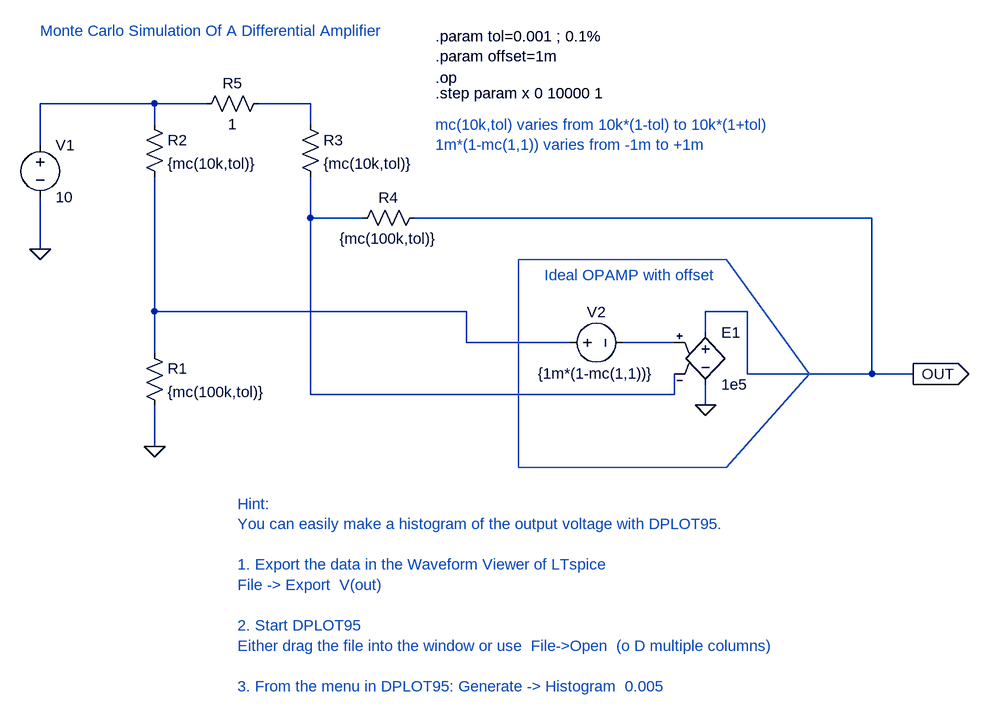
[diagram p0: schematic monte-carlo-diff-amp_1.asc]
monte-carlo-diff-amp_1.asc, the LTspice schematic file:
Version 4
SHEET 1 1364 996
WIRE 80 112 -96 112
WIRE 160 112 80 112
WIRE 320 112 240 112
WIRE 80 144 80 112
WIRE 320 144 320 112
WIRE -96 176 -96 112
WIRE 320 288 320 224
WIRE 400 288 320 288
WIRE 1184 288 480 288
WIRE -96 336 -96 256
WIRE 80 432 80 224
WIRE 560 432 80 432
WIRE 992 432 928 432
WIRE 928 464 928 432
WIRE 560 480 560 432
WIRE 720 480 560 480
WIRE 880 480 800 480
WIRE 80 496 80 432
WIRE 992 528 992 432
WIRE 1184 528 1184 288
WIRE 1184 528 992 528
WIRE 1248 528 1184 528
WIRE 320 560 320 288
WIRE 880 560 880 528
WIRE 880 560 320 560
WIRE 928 576 928 544
WIRE 80 640 80 576
FLAG -96 336 0
FLAG 80 640 0
FLAG 928 576 0
FLAG 1248 528 OUT
IOPIN 1248 528 Out
SYMBOL res 64 128 R0
SYMATTR InstName R2
SYMATTR Value {mc(10k,tol)}
SYMBOL res 64 480 R0
SYMATTR InstName R1
SYMATTR Value {mc(100k,tol)}
SYMBOL voltage -96 160 R0
SYMATTR InstName V1
SYMATTR Value 10
SYMBOL res 304 128 R0
SYMATTR InstName R3
SYMATTR Value {mc(10k,tol)}
SYMBOL res 384 304 R270
WINDOW 0 32 56 VTop 0
WINDOW 3 0 56 VBottom 0
SYMATTR InstName R4
SYMATTR Value {mc(100k,tol)}
SYMBOL e 928 448 R0
SYMATTR InstName E1
SYMATTR Value 1e5
SYMBOL voltage 704 480 R270
WINDOW 0 32 56 VTop 0
WINDOW 3 -32 56 VBottom 0
SYMATTR InstName V2
SYMATTR Value {1m*(1-mc(1,1))}
SYMBOL res 144 128 R270
WINDOW 0 32 56 VTop 0
WINDOW 3 0 56 VBottom 0
SYMATTR InstName R5
SYMATTR Value 1
TEXT 512 72 Left 0 !.op
TEXT 512 96 Left 0 !.step param x 0 10000 1
TEXT 512 8 Left 0 !.param tol=0.001 ; 0.1%\n.param offset=1m
TEXT 680 376 Left 0 ;Ideal OPAMP with offset
TEXT -96 0 Left 0 ;Monte Carlo Simulation Of A Differential Amplifier
TEXT 512 144 Left 0 ;mc(10k,tol) varies from 10k*(1-tol) to 10k*(1+tol)\n1m*(1-mc(1,1)) varies from -1m to +1m
TEXT 208 728 Left 0 ;Hint:\nYou can easily make a histogram of the output voltage with DPLOT95.\n \n1. Export the data in the Waveform Viewer of LTspice\nFile -> Export  V(out)\n \n2. Start DPLOT95\nEither drag the file into the window or use  File->Open  (o D multiple columns)\n \n3. From the menu in DPLOT95: Generate -> Histogram  0.005
LINE Normal 640 672 640 352
LINE Normal 960 352 640 352
LINE Normal 1088 528 960 352
LINE Normal 960 672 1088 528
LINE Normal 640 672 960 672

The netlist it stands for:
* monte-carlo-diff-amp_1.asc
R2 N001 N004 {mc(10k,tol)}
R1 N004 0 {mc(100k,tol)}
V1 N001 0 10
R3 N002 N003 {mc(10k,tol)}
R4 N003 OUT {mc(100k,tol)}
E1 OUT 0 N005 N003 1e5
V2 N004 N005 {1m*(1-mc(1,1))}
R5 N001 N002 1
.op
.step param x 0 10000 1
.param tol=0.001 ; 0.1%
.param offset=1m
* Ideal OPAMP with offset
* Monte Carlo Simulation Of A Differential Amplifier
* mc(10k,tol) varies from 10k*(1-tol) to 10k*(1+tol)
* 1m*(1-mc(1,1)) varies from -1m to +1m
* Hint:
* You can easily make a histogram of the output voltage with DPLOT95.
* 1. Export the data in the Waveform Viewer of LTspice
* File -> Export  V(out)
* 2. Start DPLOT95
* Either drag the file into the window or use  File->Open  (o D multiple columns)
* 3. From the menu in DPLOT95: Generate -> Histogram  0.005
.backanno
.end